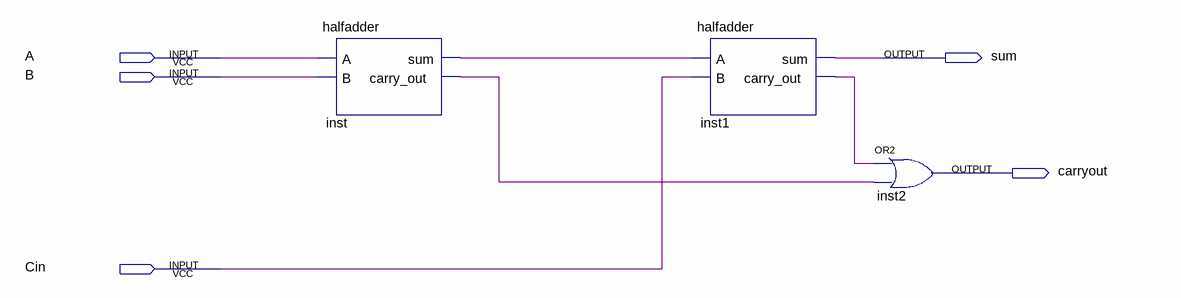
[diagram p0: schematic sheet]
// Quartus schematic fulladder.bdf as structural Verilog: 3 symbols, 5 pins
module fulladder (
  input  A,
  input  B,
  input  Cin,
  output sum,
  output carryout
);

  wire inst1_carry_out, inst_carry_out, inst_sum;

  halfadder inst (.A(A), .B(B), .sum(inst_sum), .carry_out(inst_carry_out));
  halfadder inst1 (.A(inst_sum), .B(Cin), .sum(sum), .carry_out(inst1_carry_out));
  or inst2 (carryout, inst1_carry_out, inst_carry_out);
endmodule
